# Altium schematic sheet Vibration.SchDoc
size A3
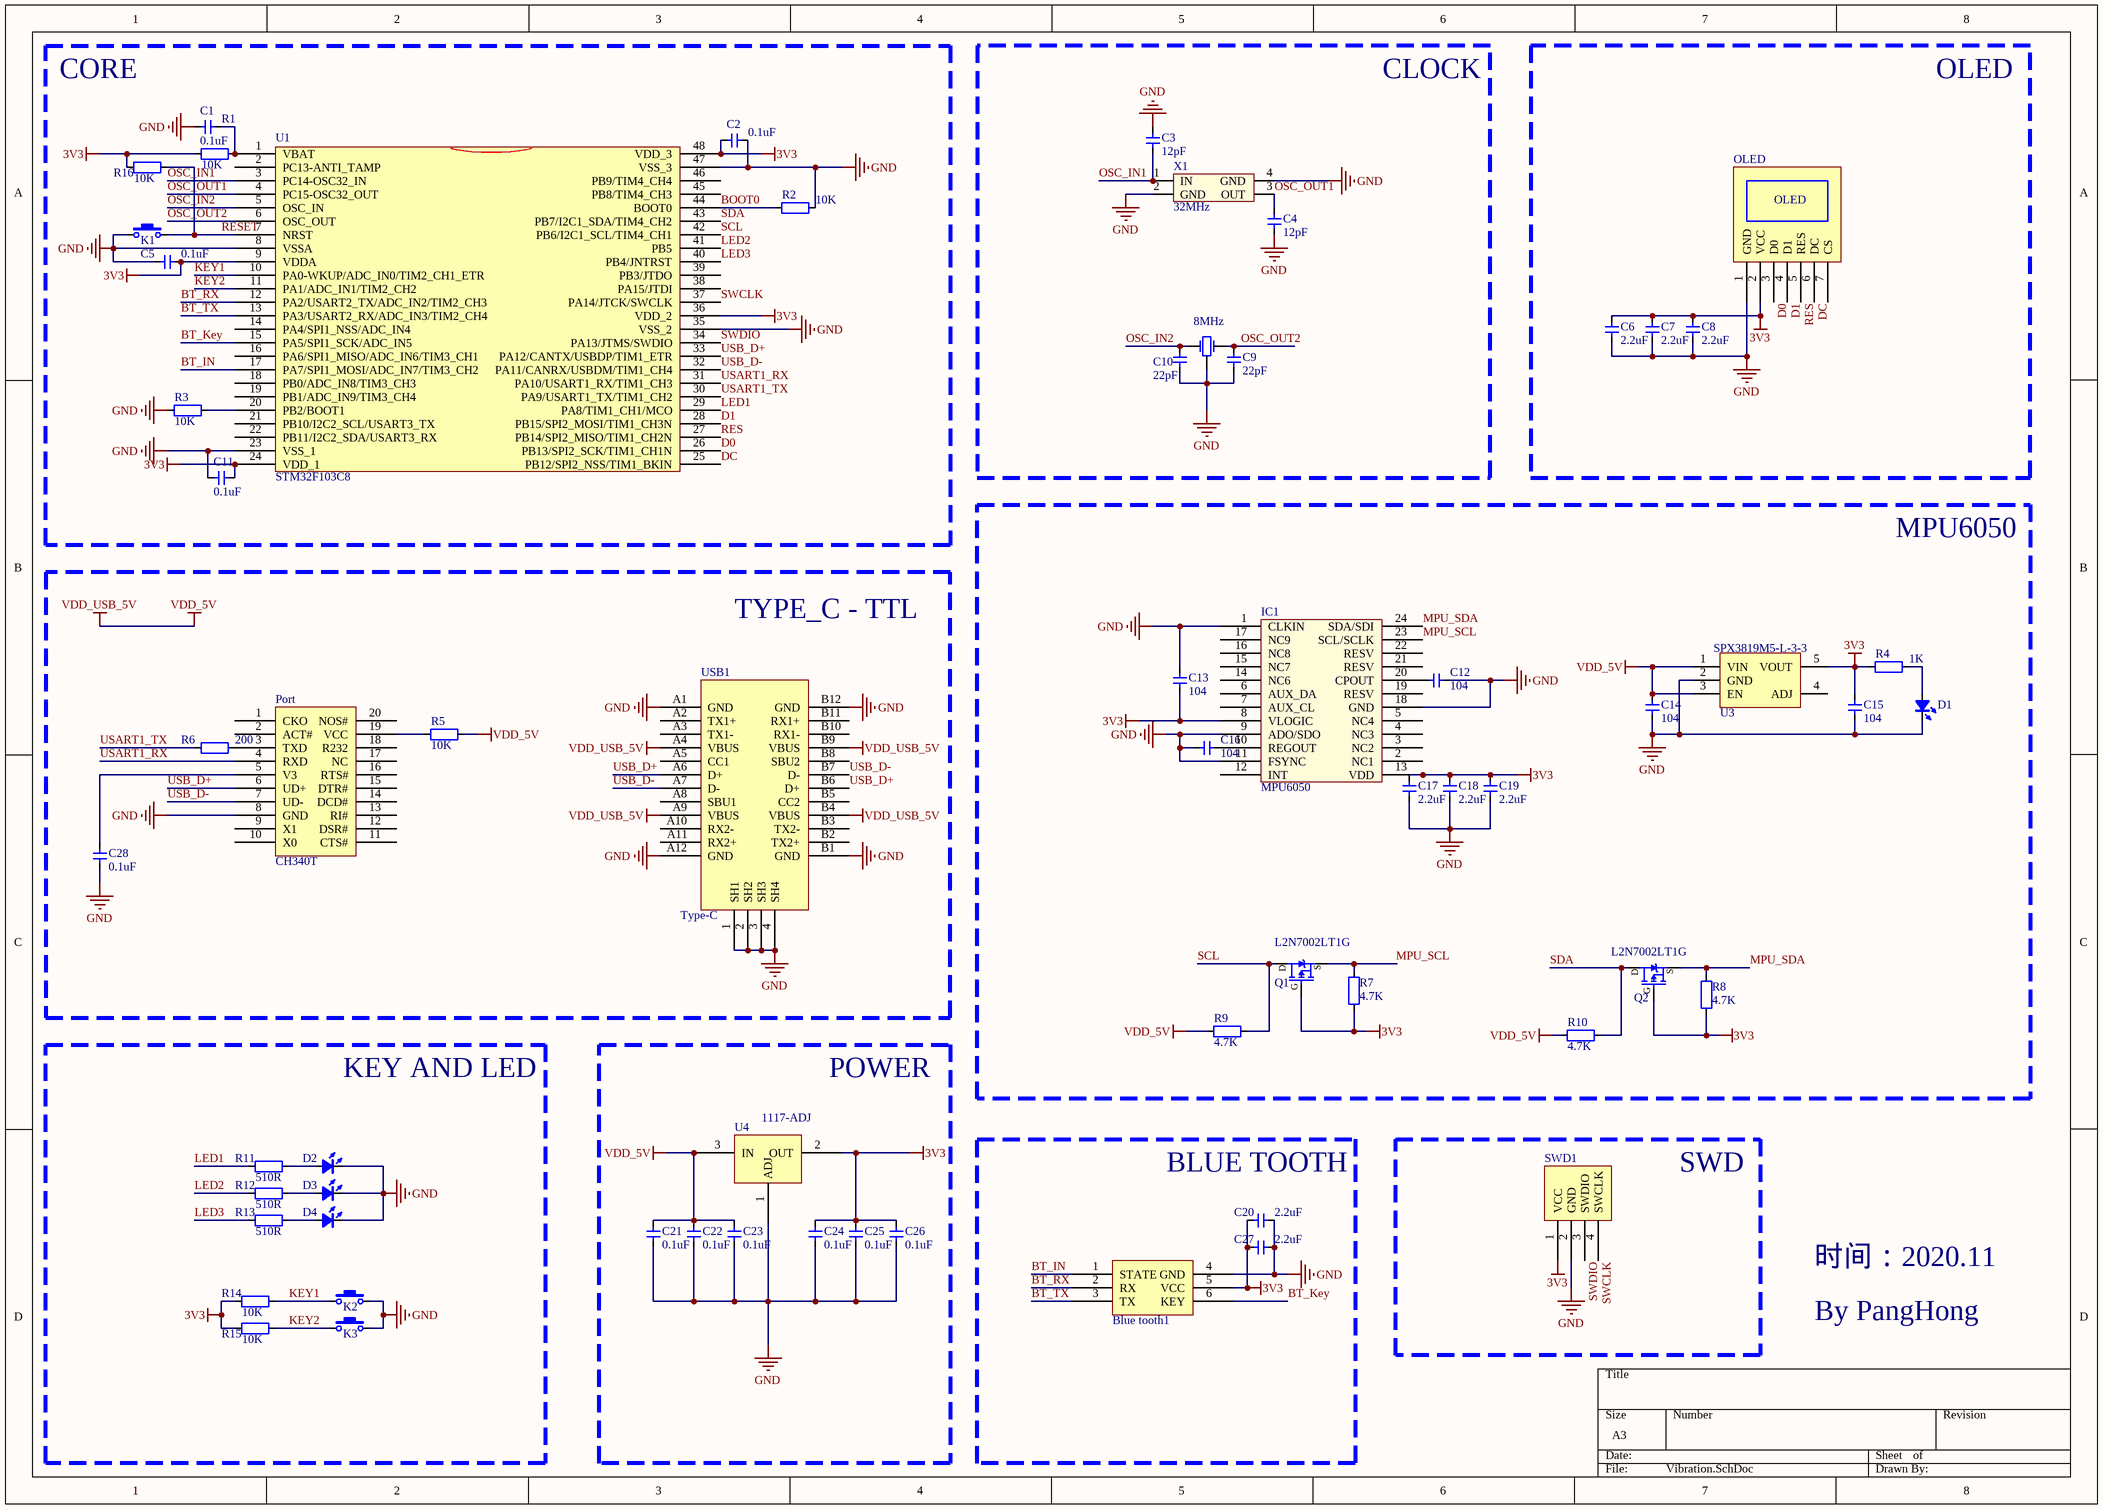
[diagram p0: Vibration.SchDoc]

## Parts
Blue_tooth1  Blue tooth  [蓝牙]  (value not drawn)
C1  0.1uF  [CAP_0402]
C2  0.1uF  [CAP_0402]
C3  12pF  [CAP_0402]
C4  12pF  [CAP_0402]
C5  0.1uF  [CAP_0402]
C6  2.2uF  [CAP_0402]
C7  2.2uF  [CAP_0402]
C8  2.2uF  [CAP_0402]
C9  22pF  [CAP_0402]
C10  22pF  [CAP_0402]
C11  0.1uF  [CAP_0402]
C12  104  [CAP_0402]
C13  104  [CAP_0402]
C14  104  [CAP_0402]
C15  104  [CAP_0402]
C16  104  [CAP_0402]
C17  2.2uF  [CAP_0402]
C18  2.2uF  [CAP_0402]
C19  2.2uF  [CAP_0402]
C20  2.2uF  [CAP_0402]
C21  0.1uF  [0603-CAP]
C22  0.1uF  [0603-CAP]
C23  0.1uF  [0603-CAP]
C24  0.1uF  [0603-CAP]
C25  0.1uF  [0603-CAP]
C26  0.1uF  [0603-CAP]
C27  2.2uF  [CAP_0402]
C28  0.1uF  [CAP_0402]
D1  color?  [LED_0402_BLUE]  (value not drawn)
D2  color?  [LED_0402_BLUE]  (value not drawn)
D3  color?  [LED_0402_BLUE]  (value not drawn)
D4  color?  [LED_0402_BLUE]  (value not drawn)
IC1  MPU6050  [QFN24 - 4*4*0.9]
K1  TACT 2P  [ButtonTACT_3x4x2_180H]  (value not drawn)
K2  TACT 2P  [ButtonTACT_3x4x2_180H]  (value not drawn)
K3  TACT 2P  [ButtonTACT_3x4x2_180H]  (value not drawn)
OLED  OLED  [OLED 0.96]  (value not drawn)
Port  CH340T  [SSOP-20]
Q1  L2N7002LT1G  [SOT23-3N]
Q2  L2N7002LT1G  [SOT23-3N]
R1  10K  [RES_0402]
R2  10K  [RES_0402]
R3  10K  [RES_0402]
R4  1K  [RES_0402]
R5  10K  [RES_0402]
R6  200  [RES_0402]
R7  4.7K  [RES_0402]
R8  4.7K  [RES_0402]
R9  4.7K  [RES_0402]
R10  4.7K  [RES_0402]
R11  510R  [RES_0402]
R12  510R  [RES_0402]
R13  510R  [RES_0402]
R14  10K  [RES_0402]
R15  10K  [RES_0402]
R16  10K  [RES_0402]
SWD1  SWD  [SWD]  (value not drawn)
U1  STM32F103C8  [LQFP48_M]
U3  SPX3819M5  [L - SOT23-5L]  (value not drawn)
U4  1117-ADJ  [SOT223_JX]
USB1  Type-C  [Type-C-TOP]
X1  32MHz  [XTAL3225   无源]
X2  8MHz  [XTAL3215]

## Blocks framed on the sheet
CORE: C1 C2 C5 C11 K1 R1-R3 R16 U1
CLOCK: C3 C4 C9 C10 X1 X2
OLED: C6-C8 OLED
MPU6050: C12-C19 D1 IC1 Q1 Q2 R4 R7-R10 U3
TYPE_C - TTL: C28 Port R5 R6 USB1
KEY AND LED: D2-D4 K2 K3 R11-R15
POWER: C21-C26 U4
BLUE TOOTH: Blue_tooth1 C20 C27
SWD: SWD1

## Nets
3V3: Blue_tooth1.5(VCC) C2.1 C5.2 C6.1 C7.1 C8.1 C11.2 C13.1 C15.1 C17.1 C18.1 C19.1 C20.1 C24.2 C25.2 C26.2 C27.1 IC1.8(VLOGIC) IC1.13(VDD) OLED.2(VCC) Q1.1(G) Q2.1(G) R1.1 R4.1 R7.1 R8.1 R14.1 R15.1 R16.2 SWD1.1(VCC) U1.9(VDDA) U1.24(VDD_1) U1.36(VDD_2) U1.48(VDD_3) U3.5(VOUT) U4.2(OUT)
GND: Blue_tooth1.4(GND) C1.1 C2.2 C3.2 C4.1 C5.1 C6.2 C7.2 C8.2 C9.1 C10.1 C11.1 C12.1 C13.2 C14.2 C15.2 C16.2 C17.2 C18.2 C19.2 C20.2 C21.1 C22.1 C23.1 C24.1 C25.1 C26.1 C27.2 C28.1 D1.2(K) D2.2(K) D3.2(K) D4.2(K) IC1.1(CLKIN) IC1.9(ADO/SDO) IC1.11(FSYNC) IC1.18(GND) K1.1 K2.2 K3.2 OLED.1(GND) Port.8(GND) R2.2 R3.1 SWD1.2(GND) U1.8(VSSA) U1.23(VSS_1) U1.35(VSS_2) U1.47(VSS_3) U3.2(GND) U4.1(ADJ) USB1.1(SH1) USB1.2(SH2) USB1.3(SH3) USB1.4(SH4) USB1.A1(GND) USB1.A12(GND) USB1.B1(GND) USB1.B12(GND) X1.2(GND) X1.4(GND) X2.2(GND)
VDD_5V: C14.1 C21.2 C22.2 C23.2 R5.2 R9.2 R10.2 U3.1(VIN) U3.3(EN) U4.3(IN) USB1.A4(VBUS) USB1.A9(VBUS) USB1.B4(VBUS) USB1.B9(VBUS)  [also labelled VDD_USB_5V]
BOOT0: R2.1 U1.44(BOOT0)
BT_IN: Blue_tooth1.1(STATE) U1.17(PA7/SPI1_MOSI/ADC_IN7/TIM3_CH2)
BT_Key: Blue_tooth1.6(KEY) U1.15(PA5/SPI1_SCK/ADC_IN5)
BT_RX: Blue_tooth1.2(RX) U1.12(PA2/USART2_TX/ADC_IN2/TIM2_CH3)
BT_TX: Blue_tooth1.3(TX) U1.13(PA3/USART2_RX/ADC_IN3/TIM2_CH4)
D0: OLED.3(D0) U1.26(PB13/SPI2_SCK/TIM1_CH1N)
D1: OLED.4(D1) U1.28(PB15/SPI2_MOSI/TIM1_CH3N)
DC: OLED.6(DC) U1.25(PB12/SPI2_NSS/TIM1_BKIN)
KEY1: K2.1 R14.2 U1.10(PA0-WKUP/ADC_IN0/TIM2_CH1_ETR)
KEY2: K3.1 R15.2 U1.11(PA1/ADC_IN1/TIM2_CH2)
LED1: R11.1 U1.29(PA8/TIM1_CH1/MCO)
LED2: R12.1 U1.41(PB5)
LED3: R13.1 U1.40(PB4/JNTRST)
MPU_SCL: IC1.23(SCL/SCLK) Q1.2(S) R7.2
MPU_SDA: IC1.24(SDA/SDI) Q2.2(S) R8.2
OSC_IN1: C3.1 U1.3(PC14-OSC32_IN) X1.1(IN)
OSC_IN2: C10.2 U1.5(OSC_IN) X2.1(OSC1)
OSC_OUT1: C4.2 U1.4(PC15-OSC32_OUT) X1.3(OUT)
OSC_OUT2: C9.2 U1.6(OSC_OUT) X2.3(OSC2)
RES: OLED.5(RES) U1.27(PB14/SPI2_MISO/TIM1_CH2N)
RESET: K1.2 R16.1 U1.7(NRST)
SCL: Q1.3(D) R9.1 U1.42(PB6/I2C1_SCL/TIM4_CH1)
SDA: Q2.3(D) R10.1 U1.43(PB7/I2C1_SDA/TIM4_CH2)
SWCLK: SWD1.4(SWCLK) U1.37(PA14/JTCK/SWCLK)
SWDIO: SWD1.3(SWDIO) U1.34(PA13/JTMS/SWDIO)
USART1_RX: Port.4(RXD) U1.31(PA10/USART1_RX/TIM1_CH3)
USART1_TX: R6.1 U1.30(PA9/USART1_TX/TIM1_CH2)
USB_D+: Port.6(UD+) U1.33(PA12/CANTX/USBDP/TIM1_ETR) USB1.A6(D+) USB1.B6(D+)
USB_D-: Port.7(UD-) U1.32(PA11/CANRX/USBDM/TIM1_CH4) USB1.A7(D-) USB1.B7(D-)
NetC1_2: C1.2 R1.2 U1.1(VBAT)
NetC12_2: C12.2 IC1.20(CPOUT)
NetC16_1: C16.1 IC1.10(REGOUT)
NetC28_2: C28.2 Port.5(V3)
NetD1_1: D1.1(A) R4.2
NetD2_1: D2.1(A) R11.2
NetD3_1: D3.1(A) R12.2
NetD4_1: D4.1(A) R13.2
NetPort_3: Port.3(TXD) R6.2
NetPort_19: Port.19(VCC) R5.1
NetR3_2: R3.2 U1.20(PB2/BOOT1)

Not connected (* = marked no-connect by the designer): IC1 2(NC1) 3(NC2) 4(NC3) 5(NC4) 6(AUX_DA) 7(AUX_CL) 12(INT) 14(NC6) 15(NC7) 16(NC8) 17(NC9) 19(RESV) 21(RESV) 22(RESV); OLED 7(CS); Port 1(CKO) 2(ACT#) 9(X1) 10(X0) 11(CTS#) 12(DSR#) 13(RI#) 14(DCD#) 15(DTR#) 16(RTS#) 17(NC) 18(R232) 20(NOS#); U1 2(PC13-ANTI_TAMP) 14(PA4/SPI1_NSS/ADC_IN4) 16(PA6/SPI1_MISO/ADC_IN6/TIM3_CH1) 18(PB0/ADC_IN8/TIM3_CH3) 19(PB1/ADC_IN9/TIM3_CH4) 21(PB10/I2C2_SCL/USART3_TX) 22(PB11/I2C2_SDA/USART3_RX) 38(PA15/JTDI) 39(PB3/JTDO) 45(PB8/TIM4_CH3) 46(PB9/TIM4_CH4); U3 4(ADJ); USB1 A2(TX1+) A3(TX1-) A5(CC1) A8(SBU1) A10(RX2-) A11(RX2+) B2(TX2+) B3(TX2-) B5(CC2) B8(SBU2) B10(RX1-) B11(RX1+)

## Notes on the sheet
- (near U3) SPX3819M5-L-3-3
- 时间：2020.11
- By PangHong

## Library data of the parts
C1-C20 C27 C28 = 电容-0402: Capacitor; Value: 0.1u
C21-C26 = 电容-0603: Capacitor; Value: 0.1u
D1-D4 = LED_0402: LED; Type: 0402; Value: color?
IC1 = MPU6000
K1-K3 = ButtonTACT_3x4x2_180: Button; value: 3x4; type: TACT 2P
Port = CH340T: Port
Q1 Q2 = SI2301: P沟道 20V/2.8A; BOM名称: 场效应管; 版权归属: 源创客; 学习资源: www.ooocke.com; 描述: P沟道 20V/2.8A
R1-R16 = 电阻-0402: Resistor; Value: 22R
U1 = STM32F103C6
U3 = SPX3819M5: 元件名称: SPX3819M5稳压器; 版权所有: Ly
U4 = AMS1117-ADJ: IC
USB1 = USB-Type-C-TOP
X1 = XTAL-无源贴片: 无源贴片晶振
X2 = XTAL-3215